# EAGLE design esp32_lora_gateway (EAGLE 9.1.1)
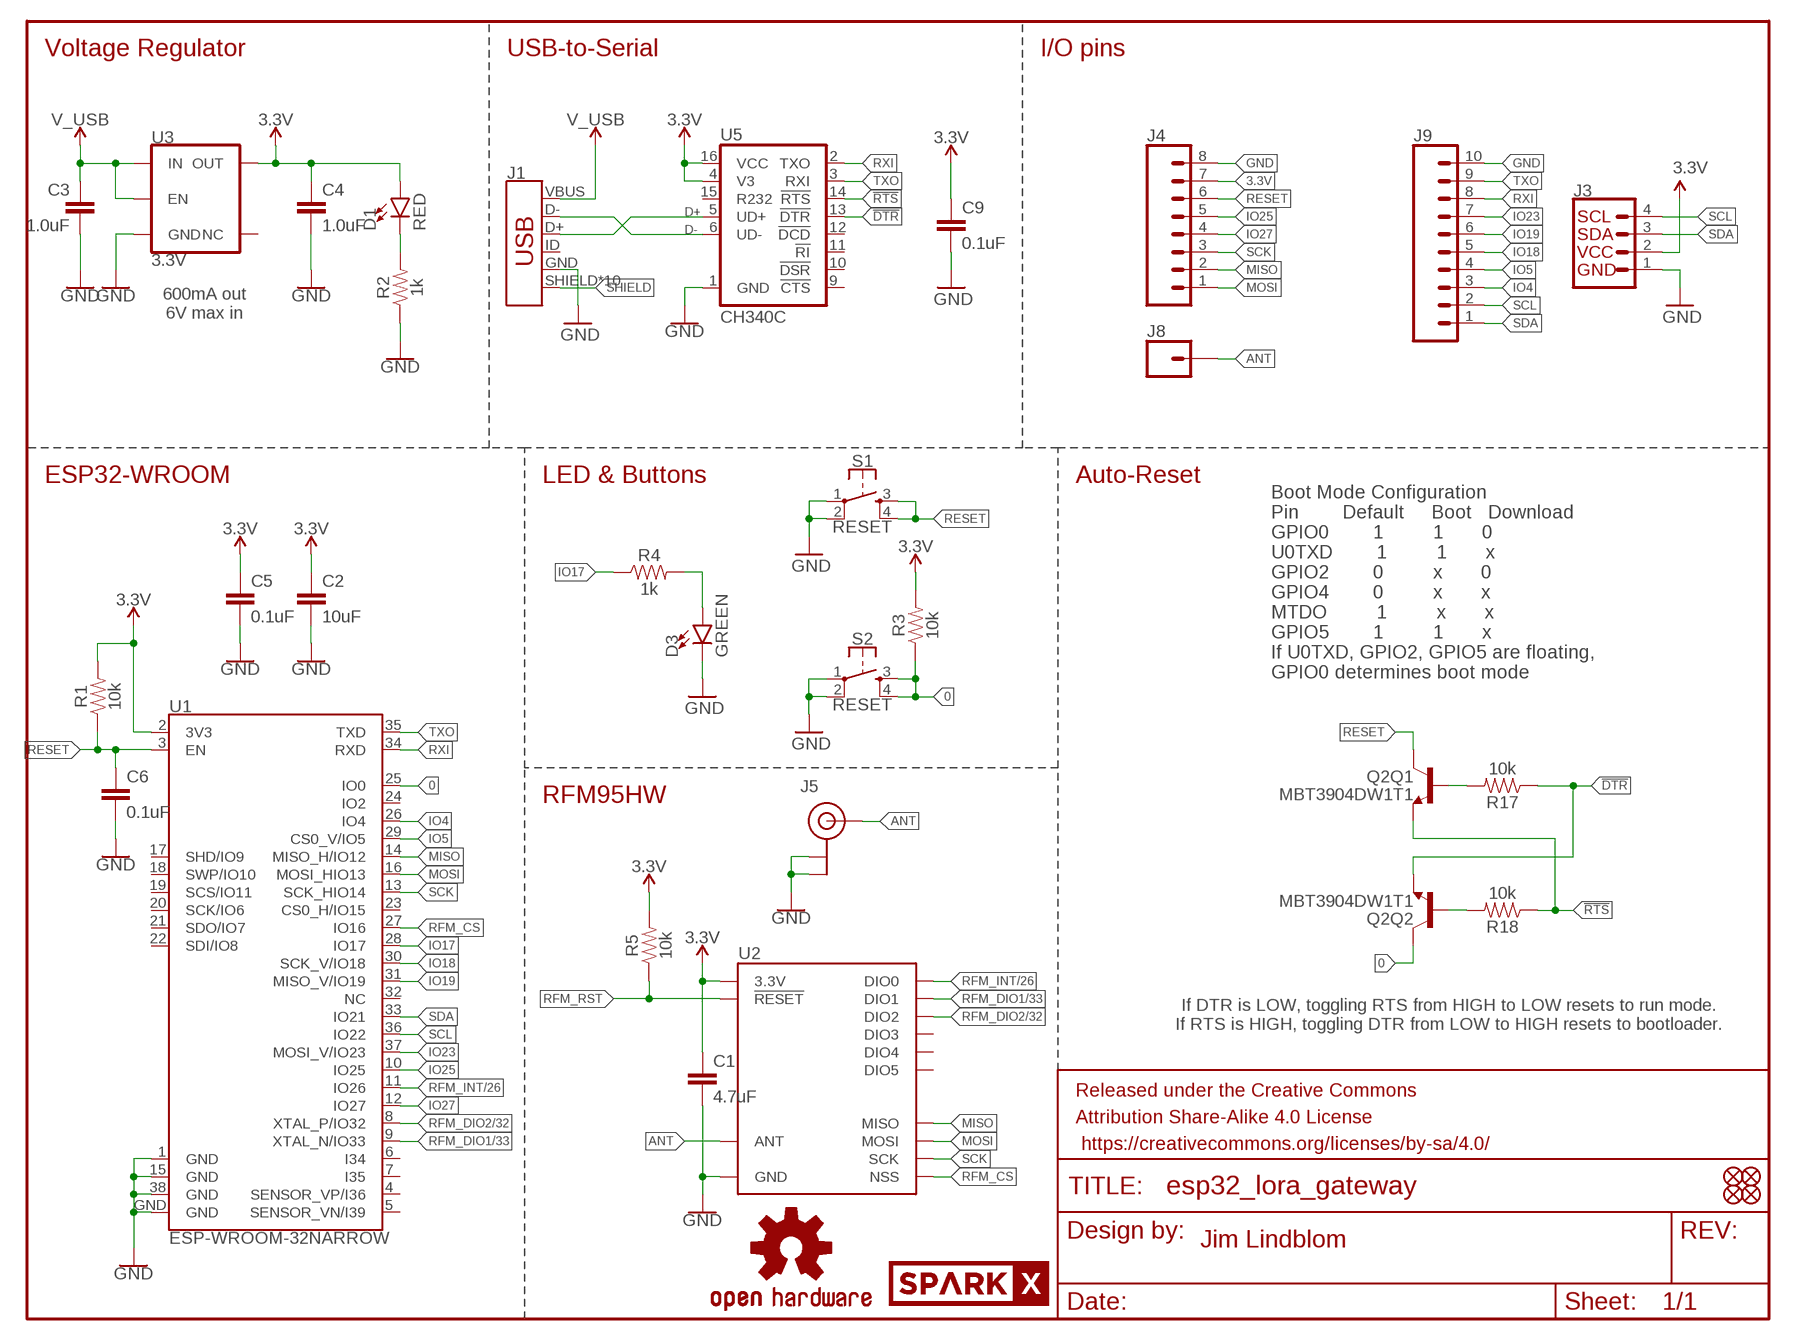
[diagram p0: schematic, sheet 1]

## Parts
C1  4.7uF  4.7UF-0603-6.3V-(10%)  [0603]
C2  10uF  10UF-0603-6.3V-20%  [0603]
C3  1.0uF  1.0UF-0603-16V-10%  [0603]
C4  1.0uF  1.0UF-0603-16V-10%  [0603]
C5  0.1uF  0.1UF-0603-25V-(+80/-20%)  [0603]
C6  0.1uF  0.1UF-0603-25V-(+80/-20%)  [0603]
C9  0.1uF  0.1UF-25V(+80/-20%)(0603)  [0603-CAP]
D1  RED  LED-RED0603  [LED-0603]
D3  GREEN  LED-GREEN0603  [LED-0603]
FD1  FIDUCIALUFIDUCIAL  [FIDUCIAL-MICRO]
FD2  FIDUCIALUFIDUCIAL  [FIDUCIAL-MICRO]
FD3  FIDUCIALUFIDUCIAL  [FIDUCIAL-MICRO]
FD4  FIDUCIALUFIDUCIAL  [FIDUCIAL-MICRO]
FRAME1  FRAME-LETTER  [CREATIVE_COMMONS]
J1  USB_MICRO-B_HALF_PTH_MILL  [USB-MICROB-PTH-MILL]
J3  QWIIC_CONNECTORJS-1MM  [1X04_1MM_RA]
J4  CONN_08NO_SILK_FEMALE_PTH  [1X08_NO_SILK]
J5  U.FL  [U.FL]
J8  CONN_01PTH_NO_SILK_YES_STOP  [1X01_NO_SILK]
J9  CONN_10NO_SILK_PTH_FEMALE  [1X10_NO_SILK]
LOGO1  SPARKX-LOGO4  [SPARKX-MEDIUM]
LOGO2  OSHW-LOGOM  [OSHW-LOGO-M]
Q2  MBT3904DW1T1  [SC70-6]
R1  10k  10KOHM-0603-1/10W-1%  [0603]
R2  1k  1KOHM-0603-1/10W-1%  [0603]
R3  10k  10KOHM-0603-1/10W-1%  [0603]
R4  1k  1KOHM-0603-1/10W-1%  [0603]
R5  10k  10KOHM-0603-1/10W-1%  [0603]
R17  10k  10KOHM-0603-1/10W-1%  [0603]
R18  10k  10KOHM-0603-1/10W-1%  [0603]
S1  RESET  MOMENTARY-SWITCH-SPST-2-SMD-4.6X2.8MM  [TACTILE_SWITCH_SMD_4.6X2.8MM]
S2  RESET  MOMENTARY-SWITCH-SPST-2-SMD-4.6X2.8MM  [TACTILE_SWITCH_SMD_4.6X2.8MM]
U1  ESP-WROOM-32NARROW  [ESP-WROOM-32-NARROW]
U2  RFM96W  [RFM95/96/97/98W]
U3  3.3V  V_REG_AP2112K-3.3V  [SOT23-5]
U5  CH340C  [SO016]

## Nets
0: Q2.6(Q2:C) R3.1 S2.3 S2.4 U1.25(IO0)
3.3V: C1.1 C2.1 C4.1 C5.1 C9.1 D1.A J3.2 J4.7 R1.2 R3.2 R5.2 U1.2(3V3) U2.3.3V U3.5(OUT) U5.4(V3) U5.16(VCC)
!DTR: Q2.1(Q2:E) R17.1 U5.13(!DTR)
!RTS: Q2.4(Q1:E) R18.1 U5.14(!RTS)
ANT: J5.FEED(SIGNAL) J8.1 U2.ANT
D+: J1.D+ U5.5(UD+)
D-: J1.D- U5.6(UD-)
GND: C1.2 C2.2 C3.2 C4.2 C5.2 C6.2 C9.2 D3.C J1.GND J3.1 J4.8 J5.1(GND) J5.2(GND) J9.10 R2.1 S1.1 S1.2 S2.1 S2.2 U1.1(GND) U1.15(GND) U1.38(GND) U1.GND U2.GND@1(GND) U2.GND@2(GND) U2.GND@3(GND) U3.2(GND) U5.1(GND)
IO4: J9.3 U1.26(IO4)
IO5: J9.4 U1.29(CS0_V/IO5)
IO17: R4.1 U1.28(IO17)
IO18: J9.5 U1.30(SCK_V/IO18)
IO19: J9.6 U1.31(MISO_V/IO19)
IO23: J9.7 U1.37(MOSI_V/IO23)
IO25: J4.5 U1.10(IO25)
IO27: J4.4 U1.12(IO27)
MISO: J4.2 U1.14(MISO_H/IO12) U2.MISO
MOSI: J4.1 U1.16(MOSI_HIO13) U2.MOSI
N$1: D1.C R2.2
N$2: D3.A R4.2
N$10: Q2.5(Q1:B) R17.2
N$12: Q2.2(Q2:B) R18.2
RESET: C6.1 J4.6 Q2.3(Q1:C) R1.1 S1.3 S1.4 U1.3(EN)
RFM_CS: U1.27(IO16) U2.NSS
RFM_DIO1/33: U1.9(XTAL_N/IO33) U2.DIO1
RFM_DIO2/32: U1.8(XTAL_P/IO32) U2.DIO2
RFM_INT/26: U1.11(IO26) U2.DIO0
RFM_RST: R5.1 U2.!RESET
RXI: J9.8 U1.34(RXD) U5.2(TXO)
SCK: J4.3 U1.13(SCK_HIO14) U2.SCK
SCL: J3.4 J9.2 U1.36(IO22)
SDA: J3.3 J9.1 U1.33(IO21)
SHIELD: J1.SHIELD J1.SHIELD2(SHIELD) J1.SHIELD3(SHIELD) J1.SHIELD4(SHIELD) J1.SHIELD5(SHIELD) J1.SHIELD6(SHIELD) J1.SHIELD7(SHIELD) J1.SHIELD8(SHIELD) J1.SHIELD9(SHIELD) J1.SHIELD10(SHIELD)
TXO: J9.9 U1.35(TXD) U5.3(RXI)
V_USB: C3.1 J1.VBUS U3.1(IN) U3.3(EN)
Unconnected: J1.ID U1.4(SENSOR_VP/I36) U1.5(SENSOR_VN/I39) U1.6(I34) U1.7(I35) U1.17(SHD/IO9) U1.18(SWP/IO10) U1.19(SCS/IO11) U1.20(SCK/IO6) U1.21(SDO/IO7) U1.22(SDI/IO8) U1.23(CS0_H/IO15) U1.24(IO2) U1.32(NC) U2.DIO3 U2.DIO4 U2.DIO5 U3.4(NC) U5.9(!CTS) U5.10(!DSR) U5.11(!RI) U5.12(!DCD) U5.15(R232)

## Notes on the sheet
- Voltage Regulator | USB-to-Serial | I/O pins
- 600mA out
  6V max in
- ESP32-WROOM | LED & Buttons | Auto-Reset
- Boot Mode Configuration
  Pin        Default     Boot   Download
  GPIO0        1         1       0
  U0TXD        1         1       x
  GPIO2        0         x       0
  GPIO4        0         x       x
  MTDO         1         x       x
  GPIO5        1         1       x
  If U0TXD, GPIO2, GPIO5 are floating, 
  GPIO0 determines boot mode
- RFM95HW
- If DTR is LOW, toggling RTS from HIGH to LOW resets to run mode.
  If RTS is HIGH, toggling DTR from LOW to HIGH resets to bootloader.
- Jim Lindblom

## Library data of the parts
C1 = SparkFun-Capacitors:4.7UF: 4.7µF ceramic capacitors A capacitor is a passive two-terminal electrical component used to store electrical energy temporarily in an electric field.; PROD_ID: CAP-08280
C2 = SparkFun-Capacitors:10UF: 10.0µF ceramic capacitors A capacitor is a passive two-terminal electrical component used to store electrical energy temporarily in an electric field.; PROD_ID: CAP-11015
C3 C4 = SparkFun-Capacitors:1.0UF: 1µF ceramic capacitors A capacitor is a passive two-terminal electrical component used to store electrical energy temporarily in an electric field.; PROD_ID: CAP-00868
C5 C6 = SparkFun-Capacitors:0.1UF: 0.1µF ceramic capacitors A capacitor is a passive two-terminal electrical component used to store electrical energy temporarily in an electric field.; PROD_ID: CAP-00810
C9 = SparkFun-Capacitors:0.1UF-25V(+80/-20%)(0603): CAP-00810 Ceramic Standard decoupling cap; PROD_ID: CAP-00810
D1 = SparkFun-LED:LED-RED: Red SMD LED Used in manufacturing of most products at SparkFun Packages: 0603 - SMD 0603 package [Product Link] <http://docs.avagotech.com/docs/AV02-0551EN> 0603 SMART - SMD 0603 SMART package ( more efficient and expensive)[Product Link] <http://www.osram-os.com/Graphics/XPic2/00077099_0.pdf> 1206 - SMD1206 package [Product Link] <https://www.sparkfun.com/datasheets/DevTools/LilyPad/Q150OVS4.pdff> SparkFun Products: Pro Mini 328 -5V <https://www.sparkfun.com/products/821> RedBoard <https://www.sparkfun.com/products/12757> IOIO-OTG <https://www.sparkfun.com/products/13613>; PROD_ID: DIO-00819
D3 = SparkFun-LED:LED-GREEN: Green SMD LED Used in manufacturing of various products at SparkFun Packages: 0603 - SMD 0603 package [Product Link] <http://www.futureelectronics.com/en/technologies/semiconductors/optoelectronics/leds/Pages/9894312-LTST-C190GKT.aspx?CrossPart=HSMG-C190&IM=0> LilyPad 1206 - SMD1206 LilyPad package [Product Link] <http://www.futureelectronics.com/en/Technologies/Product.aspx?ProductID=IN150NGHARVATEKCORPORATION2049943&IM=0> 1206 - SMD1206 package [Product Link] <http://www.futureelectronics.com/en/technologies/semiconductors/optoelectronics/leds/Pages/8315665-LTST-C150KGKT.aspx?IM=0> 1206 Bottom Mount -SMD 1206 Bottom Mount [Product Link] <http://www.digikey.com/product-detail/en/lite-on-inc/LTST-C230KGKT/160-1456-1-ND/386854> SparkFun Products: Pro Mini 328 -5V <https://www.sparkfun.com/products/821> RedBoard <https://www.sparkfun.com/products/12757> MP3 Trigger <https://www.sparkfun.com/products/13720> Makey Makey <https://www.sparkfun.com/products/11076>; PROD_ID: DIO-00821
FD1-FD4 = SparkFun-Aesthetics:FIDUCIAL: Fiducial Alignment Points Point-of-reference for pick-and-place machines and other optical instruments.
FRAME1 = SparkFun-Aesthetics:FRAME-LETTER: Schematic Frame - Letter Standard 8.5x11 US Letter frame
J1 = SparkFun-Connectors:USB_MICRO-B: USB Type Micro-B Connector Male/female and PTH/SMT variants SparkFun Products: SparkFun microB USB Breakout <https://www.sparkfun.com/products/12035> SparkFun USB microB Plug Breakout <https://www.sparkfun.com/products/10031> SparkFun ESP8266 Thing <https://www.sparkfun.com/products/13231>; PROD_ID: CONN-13711
J3 = SparkFun-Connectors:QWIIC_CONNECTOR: SparkFun I2C Standard Qwiic Connector An SMD 1mm pitch JST connector makes it easy and quick (get it? Qwiic?) to connect I2C devices to each other. The Qwiic system <http://www.sparkfun.com/qwiic> enables fast and solderless connection between popular platforms and various sensors and actuators. We carry 200mm <https://www.sparkfun.com/products/14204>, 100mm <https://www.sparkfun.com/products/14205>, 50mm <https://www.sparkfun.com/products/14206>, and breadboard friendly <https://www.sparkfun.com/products/14207> Qwiic cables. We also offer 10 pcs strips <https://www.sparkfun.com/products/14323> the SMD connectors.; PROD_ID: CONN-13694
J4 = SparkFun-Connectors:CONN_08: Multi connection point. Often used as Generic Header-pin footprint for 0.1 inch spaced/style header connections On any of the 0.1 inch spaced packages, you can populate with these: Break Away Headers - Straight <https://www.sparkfun.com/products/116> (PRT-00116) Break Away Male Headers - Right Angle <https://www.sparkfun.com/products/553> (PRT-00553) Female Headers <https://www.sparkfun.com/products/115> (PRT-00115) Break Away Headers - Machine Pin <https://www.sparkfun.com/products/117> (PRT-00117) Break Away Female Headers - Swiss Machine Pin <https://www.sparkfun.com/products/743> (PRT-00743) Arduino Stackable Header - 8 Pin <https://www.sparkfun.com/products/9279> (PRT-09279) For SCREWTERMINALS and SPRING TERMINALS visit here: Screw Terimnals on SparkFun.com <https://www.sparkfun.com/search/results?term=Screw+Terminals> (5mm/3.5mm/2.54mm spacing) This device is also useful as a general connection point to wire up your design to another part of your project. Our various solder wires solder well into these plated through hole pads. Hook-Up Wire - Assortment (Stranded, 22 AWG) <https://www.sparkfun.com/products/11375> (PRT-11375) Hook-Up Wire - Assortment (Solid Core, 22 AWG) <https://www.sparkfun.com/products/11367> (PRT-11367) View the entire wire category on our website here <https://www.sparkfun.com/categories/141> Special notes: Molex polarized connector foot print use with SKU : PRT-08231 with associated crimp pins and housings. 1MM SMD Version SKU: PRT-10208 NOTES ON THE VARIANTS LOCK and LOCK_LONGPADS... This footprint was designed to help hold the alignment of a through-hole component (i.e. 6-pin header) while soldering it into place. You may notice that each hole has been shifted either up or down by 0.005 of an inch from it's more standard position (which is a perfectly straight line). This slight alteration caused the pins (the squares in the middle) to touch the edges of the holes. Because they are alternating, it causes a "brace" to hold the component in place. 0.005 has proven to be the perfect amount of "off-center" position when using our standard breakaway headers. Although looks a little odd when you look at the bare footprint, once you have a header in there, the alteration is very hard to notice. Also,if you push a header all the way into place, it is covered up entirely on the bottom side.; PROD_ID: CONN-08438
J5 = SparkFun-Connectors:U.FL: SMD Antenna Connector - U.FL 2mm height, 3.0mm x 3.0mm receptacle size. SparkFun Products: SparkFun WiFi Shield - ESP8266 <https://www.sparkfun.com/products/13287> SparkFun ESP8266 Thing <https://www.sparkfun.com/products/13231> SparkFun MiniGen - Pro Mini Signal Generator Shield <https://www.sparkfun.com/products/11420>; PROD_ID: CONN-09193; SF_ID: WRL-09144
J8 = SparkFun-Connectors:CONN_01: Single connection point. Often used as Generic Header-pin footprint for 0.1 inch spaced/style header connections On any of the 0.1 inch spaced packages, you can populate with these: Break Away Headers - Straight <https://www.sparkfun.com/products/116> (PRT-00116) Break Away Male Headers - Right Angle <https://www.sparkfun.com/products/553> (PRT-00553) Female Headers <https://www.sparkfun.com/products/115> (PRT-00115) Break Away Headers - Machine Pin <https://www.sparkfun.com/products/117> (PRT-00117) Break Away Female Headers - Swiss Machine Pin <https://www.sparkfun.com/products/743> (PRT-00743) This device is also useful as a general connection point to wire up your design to another part of your project. Our various solder wires solder well into these plated through hole pads. Hook-Up Wire - Assortment (Stranded, 22 AWG) <https://www.sparkfun.com/products/11375> (PRT-11375) Hook-Up Wire - Assortment (Solid Core, 22 AWG) <https://www.sparkfun.com/products/11367> (PRT-11367) View the entire wire category on our website here <https://www.sparkfun.com/categories/141> Special notes: SMTSO-256-ET is a "flush mount" nut for a 4-40 screw. We mostly use this on specialty testbeds; it is a nice way to connect hardware to your PCB at an adjustable hieght. Also note, the SNAP packages are for using a snappable style connector. We sell a baggie of snaps and they are also used on two LilyPad designs: Snap Assortment - 30 pack (male and female) <https://www.sparkfun.com/products/11347> (DEV-11347) LilyPad Arduino SimpleSnap <https://www.sparkfun.com/products/10941> (DEV-10941) LilyPad SimpleSnap Protoboard <https://www.sparkfun.com/products/10940> (DEV-10940)
J9 = SparkFun-Connectors:CONN_10: Multi connection point. Often used as Generic Header-pin footprint for 0.1 inch spaced/style header connections On any of the 0.1 inch spaced packages, you can populate with these: Break Away Headers - Straight <https://www.sparkfun.com/products/116> (PRT-00116) Break Away Male Headers - Right Angle <https://www.sparkfun.com/products/553> (PRT-00553) Female Headers <https://www.sparkfun.com/products/115> (PRT-00115) Break Away Headers - Machine Pin <https://www.sparkfun.com/products/117> (PRT-00117) Break Away Female Headers - Swiss Machine Pin <https://www.sparkfun.com/products/743> (PRT-00743) Arduino Stackable Header - 10 Pin <https://www.sparkfun.com/products/11376> (PRT-11376) For SCREWTERMINALS and SPRING TERMINALS visit here: Screw Terimnals on SparkFun.com <https://www.sparkfun.com/search/results?term=Screw+Terminals> (5mm/3.5mm/2.54mm spacing) This device is also useful as a general connection point to wire up your design to another part of your project. Our various solder wires solder well into these plated through hole pads. Hook-Up Wire - Assortment (Stranded, 22 AWG) <https://www.sparkfun.com/products/11375> (PRT-11375) Hook-Up Wire - Assortment (Solid Core, 22 AWG) <https://www.sparkfun.com/products/11367> (PRT-11367) View the entire wire category on our website here <https://www.sparkfun.com/categories/141> Special notes: Molex polarized connector foot print use with SKU : PRT-08231 with associated crimp pins and housings. 1MM SMD Version SKU: PRT-10208 NOTES ON THE VARIANTS LOCK and LOCK_LONGPADS... This footprint was designed to help hold the alignment of a through-hole component (i.e. 6-pin header) while soldering it into place. You may notice that each hole has been shifted either up or down by 0.005 of an inch from it's more standard position (which is a perfectly straight line). This slight alteration caused the pins (the squares in the middle) to touch the edges of the holes. Because they are alternating, it causes a "brace" to hold the component in place. 0.005 has proven to be the perfect amount of "off-center" position when using our standard breakaway headers. Although looks a little odd when you look at the bare footprint, once you have a header in there, the alteration is very hard to notice. Also,if you push a header all the way into place, it is covered up entirely on the bottom side.; PROD_ID: CONN-11563
LOGO1 = SparkX:SPARKX-LOGO
LOGO2 = SparkFun-Aesthetics:OSHW-LOGO: Open-Source Hardware (OSHW) Logo This logo indicates the piece of hardware it is found on incorporates a OSHW license and/or adheres to the definition of open source hardware found here: http://freedomdefined.org/OSHW
Q2 = esp32-thing-temp:MBT3904DW1T1: MBT3904DW1 Dual NPN Transistors The MBT3904W1 puts two general purpose 3904 NPN transistors in a single package. Datasheet <http://www.onsemi.com/pub_link/Collateral/MBT3904DW1T1-D.PDF>; PROD_ID: TRANS-13337
R1 R3 R5 R17 R18 = SparkFun-Resistors:10KOHM: 10kΩ resistor A resistor is a passive two-terminal electrical component that implements electrical resistance as a circuit element. Resistors act to reduce current flow, and, at the same time, act to lower voltage levels within circuits. - Wikipedia; PROD_ID: RES-00824
R2 R4 = SparkFun-Resistors:1KOHM: 1kΩ resistor A resistor is a passive two-terminal electrical component that implements electrical resistance as a circuit element. Resistors act to reduce current flow, and, at the same time, act to lower voltage levels within circuits. - Wikipedia; PROD_ID: RES-07856
S1 S2 = SparkFun-Switches:MOMENTARY-SWITCH-SPST-2: Momentary Switch (Pushbutton) - SPST - Two Circuits Normally-open (NO) SPST momentary switches (buttons, pushbuttons). Schematic symbol includes two switch circuits. Variants SMD-4.6MMX2.8MM - 4.60mm x 2.80mm Tactile Momentary Button Switch - Used on SparkFun SAMD21 Mini Breakout <https://www.sparkfun.com/products/13664> SMD-5.2MM - Mini Pushbutton Switch - SMD <https://www.sparkfun.com/products/8720> - Used on Arduino Pro Mini <https://www.sparkfun.com/products/11114>; PROD_ID: SWCH-13065
U1 = esp32_lora_gateway:ESP-WROOM-32
U2 = SparkX:RFM96W
U3 = SparkFun-IC-Power:V_REG_AP2112: AP2112 - 600mA CMOS LDO Regulator w/ Enable The AP2112 is CMOS process low dropout linear regulator with enable function, the regulator delivers a guaranteed 600mA (min.) continuous load current. Features Output Voltage Accuracy: ±1.5% Output Current: 600mA (Min.) Foldback Short Current Protection: 50mA Enable Function to Turn ON/OFF VOUT Low Dropout Voltage (3.3V): 250mV (Typ.) @IOUT=600mA Excellent Load Regulation: 0.2%/A (Typ.) Excellent Line Regulation: 0.02%/V (Typ.) Low Quiescent Current: 55μA (Typ.) Low Standby Current: 0.01μA (Typ.) Low Output Noise: 50μVRMS PSRR: 100Hz -65dB, 1kHz -65dB OTSD Protection Stable with 1.0μF Flexible Cap: Ceramic, Tantalum and Aluminum Electrolytic Operation Temperature Range: -40°C to 85°C ESD: MM 400V, HBM 4000V; PROD_ID: VREG-12457
U5 = SparkFun-IC-Comms:CH340C; PROD_ID: IC-14038

## Net classes
0 default: width 0.152 mm, drill 0.305 mm
1 power: width 0.178 mm

## Board
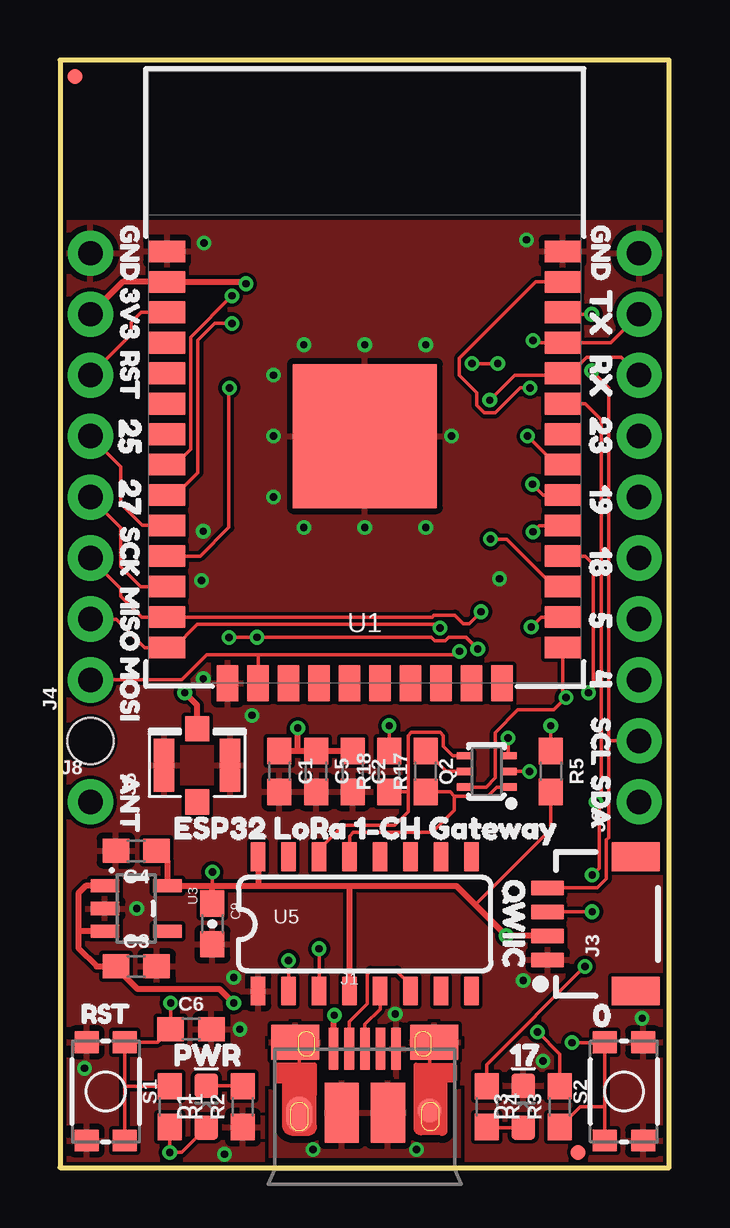
[diagram p1: board, top side]
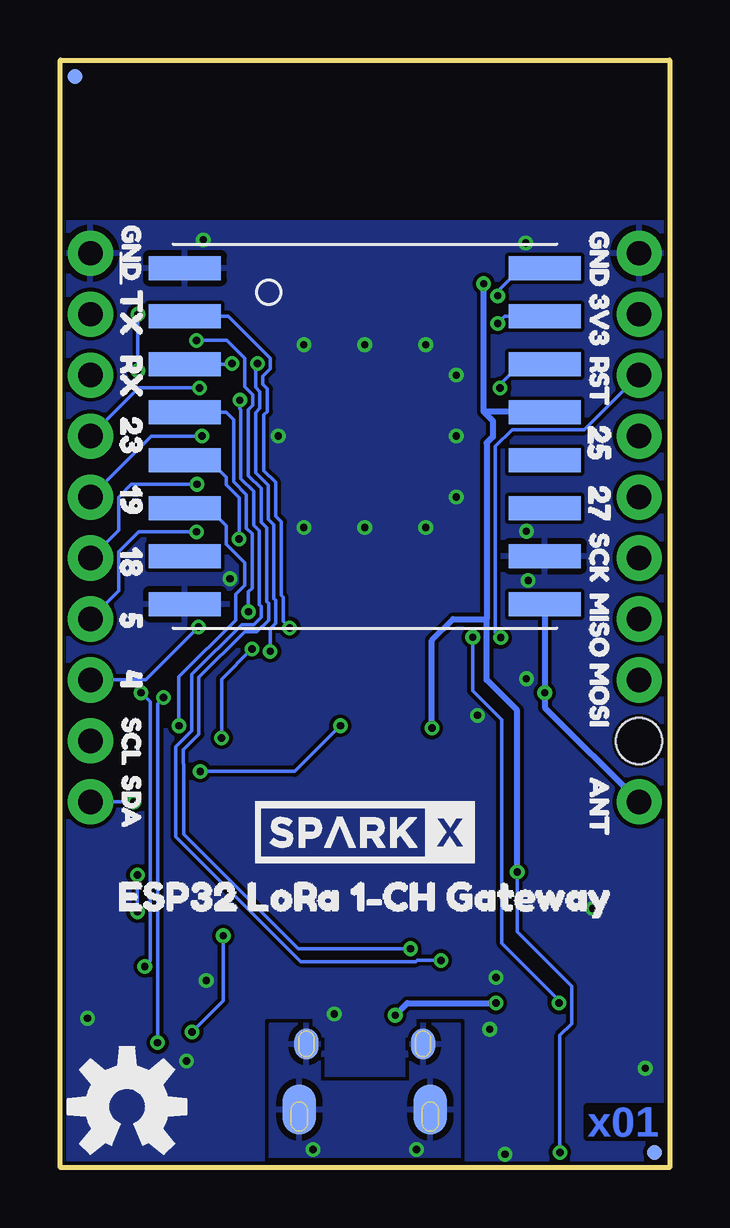
[diagram p2: board, bottom side, seen from below]

Size 25.38 x 46.15 mm. Coordinates in mm from the lower left corner, seen from the top.
Outline: 0,0 25.38,0 25.38,46.15 0,46.15 0,0
Copper layers (1*16): Top 0.035mm / dielectric 1.5mm / Bottom 0.035mm
Design rules "SparkFun-2-layer-PCBWay-LIMIT": minimum track width 6mil, minimum drill 0.3mm, track to track 6mil, track to pad 6mil, pad to pad 6mil, via to via 6mil, smd to smd 6mil, copper to edge 6mil, drill to drill 6mil, minimum pad ring 6mil, minimum via ring 6mil, stop-mask expansion 4mil, vias tented up to drill 25mil, thermal gap 10mil
Holes 1.93 mm at 1.27,17.78

### Footprints (pad centres in the part's own frame; a part is rotated, then mirrored left to right if it is on the bottom)
0603 = smd 1.1 x 1: 1 -0.85,0; 2 0.85,0
0603-CAP = smd 1.1 x 1: 1 -0.85,0; 2 0.85,0
LED-0603 = smd 1 x 1: A -0.877,0; C 0.877,0
FIDUCIAL-MICRO = smd 0.635 x 0.635: 1 0,0
USB-MICROB-PTH-MILL = smd 0.4 x 1.75: D+ 0,0; D- -0.65,0; GND 1.3,0; ID 0.65,0; VBUS -1.3,0 | smd 2 x 1.46: SHIELD -2.9,0.275; SHIELD2 2.9,0.275 | smd 1.425 x 2.5: SHIELD3 -0.963,-2.675; SHIELD4 0.963,-2.675 | smd 1.4 x 2.1 bottom: SHIELD5 -2.731,-2.531; SHIELD7 2.729,-2.531 | smd 1 x 1: SHIELD6 2.7,-2.575 | smd 1.1 x 1.5: SHIELD8 -2.731,-2.731 | smd 1 x 1.3 bottom: SHIELD9 -2.43,0.195; SHIELD10 2.43,0.195
1X04_1MM_RA = smd 0.6 x 1.35: 1 -1.5,0; 2 -0.5,0; 3 0.5,0; 4 1.5,0 | smd 1.2 x 2: NC1 2.8,-3.675; NC2 -2.8,-3.675
1X08_NO_SILK = drill 1.016 pad 1.88: 1 0,0; 2 2.54,0; 3 5.08,0; 4 7.62,0; 5 10.16,0; 6 12.7,0; 7 15.24,0; 8 17.78,0
U.FL = smd 2.2 x 0.85: 1 0,1.375; 2 0,-1.375 | smd 1.05 x 1: FEED 1.525,0; NC -1.525,0
1X01_NO_SILK = drill 1.016 pad 1.88: 1 0,0
1X10_NO_SILK = drill 1.016 pad 1.88: 1 0,0; 2 2.54,0; 3 5.08,0; 4 7.62,0; 5 10.16,0; 6 12.7,0; 7 15.24,0; 8 17.78,0; 9 20.32,0; 10 22.86,0
SC70-6 = smd 0.3 x 0.66: 1 -0.65,-0.92; 2 0,-0.92; 3 0.65,-0.92; 4 0.65,0.92; 5 0,0.92; 6 -0.65,0.92
TACTILE_SWITCH_SMD_4.6X2.8MM = smd 0.9 x 1: 1 -2.05,-0.8; 2 2.05,-0.8; 3 2.05,0.8; 4 -2.05,0.8
ESP-WROOM-32-NARROW = smd 0.9 x 1.5: 1 6.43,8.238; 2 5.16,8.238; 3 3.89,8.238; 4 2.62,8.238; 5 1.35,8.238; 6 0.08,8.238; 7 -1.19,8.238; 8 -2.46,8.238; 9 -3.73,8.238; 10 -5,8.238; 11 -6.27,8.238; 12 -7.54,8.238; 13 -8.81,8.238; 14 -10.08,8.238; 25 -10.08,-8.238; 26 -8.81,-8.238; 27 -7.54,-8.238; 28 -6.27,-8.238; 29 -5,-8.238; 30 -3.73,-8.238; 31 -2.46,-8.238; 32 -1.19,-8.238; 33 0.08,-8.238; 34 1.35,-8.238; 35 2.62,-8.238; 36 3.89,-8.238; 37 5.16,-8.238; 38 6.43,-8.238 | smd 1.5 x 0.9: 15 -11.57,5.715; 16 -11.57,4.445; 17 -11.57,3.175; 18 -11.57,1.905; 19 -11.57,0.635; 20 -11.57,-0.635; 21 -11.57,-1.905; 22 -11.57,-3.175; 23 -11.57,-4.445; 24 -11.57,-5.715 | smd 6 x 6: GND -1.27,0
RFM95/96/97/98W = smd 3 x 1: 3.3V 7.5,1; !RESET -7.5,-3; ANT 7.5,-7; DIO0 7.5,3; DIO1 7.5,5; DIO2 7.5,7; DIO3 7.5,-3; DIO4 7.5,-1; DIO5 -7.5,-5; GND@1 -7.5,7; GND@2 -7.5,-7; GND@3 7.5,-5; MISO -7.5,5; MOSI -7.5,3; NSS -7.5,-1; SCK -7.5,1
SOT23-5 = smd 0.55 x 1.2: 1 -0.95,-1.3; 2 0,-1.3; 3 0.95,-1.3; 4 0.95,1.3; 5 -0.95,1.3
SO016 = smd 0.6 x 1.2: 1 -4.445,-2.8; 2 -3.175,-2.8; 3 -1.905,-2.8; 4 -0.635,-2.8; 5 0.635,-2.8; 6 1.905,-2.8; 7 3.175,-2.8; 8 4.445,-2.8; 9 4.445,2.8; 10 3.175,2.8; 11 1.905,2.8; 12 0.635,2.8; 13 -0.635,2.8; 14 -1.905,2.8; 15 -3.175,2.8; 16 -4.445,2.8

### Placement (x,y rotation side)
C1  9.14,16.51 270 top
C2  12.19,16.51 270 top
C3  3.17,8.38 0 top
C4  3.17,13.21 180 top
C5  10.67,16.51 270 top
C6  5.46,5.77 0 top
C9  6.35,10.16 270 top
D1  6.1,2.54 90 top
D3  19.3,2.54 90 top
FD1  24.77,45.47 0 bottom
FD2  0.64,0.64 0 bottom
FD3  21.59,0.64 0 top
FD4  0.64,45.47 0 top
FRAME1  2.54,-7.62 0 top  (outside the outline)
J1  12.7,4.95 0 top
J3  20.32,10.16 90 top
J4  1.27,20.32 90 top
J5  5.71,16.76 90 top
J8  1.27,15.24 0 top
J9  24.13,15.24 90 top
LOGO1  12.7,13.97 0 bottom
LOGO2  22.61,2.54 0 bottom
Q2  17.78,16.51 90 top
R1  4.57,2.54 270 top
R2  7.62,2.54 90 top
R3  20.83,2.54 90 top
R4  17.78,2.54 270 top
R5  20.45,16.51 270 top
R17  15.24,16.51 90 top
R18  13.72,16.51 90 top
S1  1.91,3.17 270 top
S2  23.5,3.17 90 top
U1  12.7,31.75 90 top
U2  12.7,30.48 0 bottom
U3  3.17,10.79 270 top
U5  12.7,10.16 0 top
U$1  [GND0]  2.92,39.94 270 top
U$2  [3V31]  2.92,37.34 270 top
U$3  [RST2]  2.92,34.73 270 top
U$4  [2517]  2.92,32 270 top
U$5  [279]  2.92,29.46 270 top
U$6  [SCK3]  2.92,27.37 270 top
U$7  [MISO4]  2.92,24.89 270 top
U$8  [MOSI5]  2.92,21.97 270 top
U$9  [ANT6]  2.92,17.12 270 top
U$10  [GND0]  22.54,39.94 270 top
U$11  [TX16]  22.54,37.34 270 top
U$12  [RX15]  22.54,34.67 270 top
U$13  [2314]  22.54,32.07 270 top
U$14  [1912]  22.54,29.21 270 top
U$15  [1811]  22.54,26.67 270 top
U$16  [513]  22.54,23.94 270 top
U$17  [410]  22.54,21.53 270 top
U$18  [SCL8]  22.54,19.43 270 top
U$19  [SDA7]  22.54,17.02 270 top
U$20  [RST2]  0.19,6.41 0 top
U$21  [020]  21.4,6.35 0 top
U$22  [PWR19]  3.94,4.7 0 top
U$23  [1722]  17.97,4.7 0 top
U$24  [QWIIC18]  18.92,12.95 270 top
U$25  [ESP32_LORA_1#CH_GATEWAY21]  3.94,14.16 0 top
U$26  [GND0]  22.42,39.94 270 bottom
U$27  [TX16]  22.42,37.34 270 bottom
U$28  [RX15]  22.42,34.67 270 bottom
U$29  [2314]  22.42,32.07 270 bottom
U$30  [1912]  22.42,29.21 270 bottom
U$31  [1811]  22.42,26.67 270 bottom
U$32  [513]  22.42,23.94 270 bottom
U$33  [410]  22.42,21.53 270 bottom
U$34  [SCL8]  22.42,19.43 270 bottom
U$35  [SDA7]  22.42,17.02 270 bottom
U$36  [ANT6]  2.92,16.99 270 bottom
U$37  [GND0]  2.92,39.69 270 bottom
U$38  [3V31]  2.92,37.08 270 bottom
U$39  [RST2]  2.92,34.48 270 bottom
U$40  [2517]  2.92,31.75 270 bottom
U$41  [279]  2.92,29.21 270 bottom
U$42  [SCK3]  2.92,27.11 270 bottom
U$43  [MISO4]  2.92,24.64 270 bottom
U$44  [MOSI5]  2.92,21.72 270 bottom
U$45  [ESP32_LORA_1#CH_GATEWAY23]  24,11.3 0 bottom

### Tracks (layer width: path | path; a pad name or v marks a point on that pad's centre or on a via)
0  (via drill 0.3)
  Top 0.152: Q2.6 17.77,15.86 18.14,16.24 18.14,17.68 18.14,17.69 18.14,18.13 19.08,19.07 20.57,19.07 v21.08,19.59 20.94,19.73 U1.25 20.94,21.59 | v21.34,5.21 22.68,5.21 | 22.68,5.21 S2.3 | S2.4 22.7,2.54 | 22.7,2.54 22.7,5.19 22.68,5.21 | R3.1 21.68,2.54 22.7,2.54
  Bottom 0.152: v21.08,19.59 21.34,19.34 v21.34,5.21
3.3V  (via drill 0.3)
  Top 0.152: R1.2 v4.57,0.64 5.07,0.64 D1.A | v6.35,12.32 6.35,11.74 | R5.2 20.45,14.1 17.3,10.95 | R3.2 20.83,4.72 v19.9,5.66
  Top 0.254: v7.75,36.83 7.67,36.91 U1.2 2.62,36.91 J4.7 | C4.1 4.47,12.76 U3.5 6.35,11.74 | 6.35,11.74 8.26,11.74 | 8.26,11.74 12.06,11.74 | 12.06,11.74 16.51,11.74 17.3,10.95 v18.59,9.66 J3.2 | U5.16 8.26,11.74 | C9.1 6.35,11.74 | U5.4 12.06,11.74 | C2.1 C5.1 9.91,17.36 | 9.91,17.36 C1.1 | 9.91,17.36 v9.91,18.31
  Bottom 0.152: v4.57,0.64 4.57,5.51 4.08,6 4.08,7.56 6.35,9.83 v6.35,12.32 | v19.9,5.66 18.59,6.96 v18.59,9.66
  Bottom 0.254: 7.62,22.86 7.62,20.32 6.35,19.05 v6.35,12.32 | 7.75,31.5 v7.75,36.83 | U2.3.3V 5.22,31.5 7.75,31.5 | v9.91,18.31 9.91,21.97 9.02,22.86 7.62,22.86 | 7.75,31.5 7.37,31.11 7.37,30.45 7.62,30.2 7.62,22.86
!DTR
  Top 0.152: 12.06,13.21 U5.13 12.06,13.82 12.22,13.97 15.52,13.97 16.43,14.88 16.43,15.48 | R17.1 16.26,15.66 16.43,15.48 | 16.43,15.48 17.82,15.48 18.2,15.86 Q2.1
!RTS
  Top 0.152: Q2.4 16.37,17.16 15.97,17.56 15.97,18 15.84,18.14 14.64,18.14 14.51,18 14.51,15.66 | R18.1 14.51,15.66 | U5.14 10.79,13.26 11.81,14.28 13.95,14.28 14.5,14.83 14.5,15.65 14.51,15.66
ANT  (via drill 0.3)
  Top 0.254: J5.FEED 5.71,19.27 v5.2,19.79
  Bottom 0.254: 4.18,23.48 U2.ANT v5.2,19.79 5.2,19.17 J8.1
D+
  Top 0.152: J1.D+ 12.7,5.97 13.34,6.6 U5.5
D-
  Top 0.152: J1.D- 12.05,6.08 12.81,6.84 12.81,8.05 12.94,8.19 14.04,8.19 14.61,7.62 U5.6
GND  (via drill 0.3)
  other vias: 12.7,34.29 12.7,26.67 8.89,30.48 8.89,27.94 10.16,26.67 8.89,33.02 10.16,34.29 15.24,34.29 1.02,4.14 20.13,4.45 24.26,6.22 19.43,38.66 5.99,38.53 3.2,10.79 7.24,7.92 5.89,24.46 5.97,26.52 18.31,24.54 16.31,30.48 15.24,26.67 6.86,0.56 7.49,5.77 13.97,6.4 19.3,7.8 5.97,20.37 8,18.85
  pour Top (isolate 0.152, rank 6): 0,0 0,39.37 25.4,39.37 25.4,0
  pour Bottom (isolate 0.152, rank 6): 25.4,0 25.4,39.37 0,39.37 0,0
IO4  (via drill 0.3)
  Top 0.152: U1.26 20.05,22.94 v19.63,22.52
  Bottom 0.152: v19.63,22.52 21.84,20.32 J9.3
IO5  (via drill 0.3)
  Top 0.152: U1.29 19.97,26.75 v19.71,26.49
  Bottom 0.152: v19.71,26.49 22.12,26.49 22.96,25.65 22.96,24.03 J9.4
IO17  (via drill 0.3)
  Top 0.152: R4.1 17.78,4.29 v21.87,8.38 | v22.02,19.79 22.23,19.99 22.23,25.15 21.89,25.48 U1.28
  Bottom 0.152: v21.87,8.38 21.64,8.61 21.64,19.41 v22.02,19.79
IO18  (via drill 0.3)
  Top 0.152: U1.30 20.14,28.02 v19.68,28.47
  Bottom 0.152: v19.68,28.47 22.43,28.47 22.96,27.94 22.96,26.57 J9.5
IO19  (via drill 0.3)
  Top 0.152: U1.31 20.67,29.29 v19.48,30.48
  Bottom 0.152: v19.48,30.48 21.59,30.48 J9.6
IO23  (via drill 0.3)
  Top 0.152: U1.37 19.82,36.91 16.64,33.72 16.64,33.02 17.37,32.28 17.37,31.76 17.69,31.45 18.13,31.45 19.17,32.49 v19.58,32.49
  Bottom 0.152: v19.58,32.49 22.12,32.49 J9.7
IO25
  Top 0.152: J4.5 2.54,29.21 2.54,27.66 3.43,26.77 4.44,26.77 U1.10
IO27
  Top 0.152: J4.4 2.54,26.67 2.54,25.04 3.37,24.21 U1.12
MISO  (via drill 0.3)
  Top 0.152: J4.2 2.34,22.86 3.53,21.67 U1.14 4.75,21.67 5.72,22.64 15.68,22.64 v15.83,22.49
  Bottom 0.152: U2.MISO 18.39,35.48 16.64,33.72 16.64,33.28 16.95,32.97 16.95,32.63 16.76,32.45 16.76,31.5 16.91,31.36 16.91,29.04 16.41,28.55 16.41,27.15 16.18,26.91 16.18,23.84 16.1,23.76 16.1,22.76 v15.83,22.49
MOSI  (via drill 0.3)
  Top 0.152: 8.26,20.43 U1.16 8.26,21.36 | v16.64,21.51 16.49,21.36 8.26,21.36 | v17.17,33.5 v18.24,33.5 | J4.1 5.08,20.32 6.12,21.36 8.26,21.36
  Bottom 0.152: U2.MOSI 18.26,33.48 v18.24,33.5 | v17.17,33.5 17.25,33.42 17.25,32.51 17.07,32.33 17.07,31.63 17.25,31.45 17.25,28.96 16.72,28.43 16.72,27.02 16.48,26.79 16.48,23.71 16.41,23.63 16.41,22.69 16.64,22.45 v16.64,21.51
N$1
  Top 0.152: D1.C 7.59,3.42 R2.2
N$2
  Top 0.152: D3.A 17.81,1.66 R4.2
N$10
  Top 0.152: R17.2 16.09,16.51 Q2.5
N$12  (via drill 0.3)
  Top 0.152: v19.56,16.51 Q2.2 | R18.2 v13.72,18.41
  Bottom 0.152: v19.56,16.51 15.62,16.51 v13.72,18.41
RESET  (via drill 0.3)
  Top 0.152: v18.67,17.91 18.67,17.19 Q2.3 | S1.3 2.71,3.39 | 2.71,3.39 S1.4 4.07,5.22 C6.1 v4.61,6.86 | R1.1 2.71,3.39 | 16.97,22.05 v17.4,21.61 16.92,22.1 16.19,22.1 16.05,21.96 15.61,21.96 15.47,22.1 v8.2,22.1 v7.05,22.1 v7.04,22.09 | U1.3 3.38,35.64 2.97,35.23 2.97,34.72 J4.6
  Bottom 0.152: v4.61,6.86 4.61,6.97 6.99,9.35 6.99,18.66 8.2,19.88 v8.2,22.1 | v7.04,22.09 7.26,22.32 7.26,30.05 6.56,30.75 3.56,30.75 1.29,33.02 J4.6 | v18.67,17.91 18.67,20.35 v17.4,21.61
RFM_CS  (via drill 0.3)
  Top 0.152: U1.27 20.6,24.21 18.61,26.19 v17.94,26.19
  Bottom 0.152: U2.NSS 19.19,29.48 18.47,28.76 18.47,28.45 17.94,27.92 v17.94,26.19
RFM_DIO1/33  (via drill 0.3)
  Top 0.152: v7.16,35.18 6.45,35.18 5.75,34.48 5.75,28.96 4.8,28.02 U1.9
  Bottom 0.152: 6.47,35.76 5.48,35.76 U2.DIO1 6.86,35.48 v7.16,35.18
RFM_DIO2/32  (via drill 0.3)
  Top 0.152: U1.8 4.8,29.29 5.44,29.93 5.44,34.6 v7.16,36.33
  Bottom 0.152: v7.16,36.33 7.16,36.52 6.21,37.48 U2.DIO2
RFM_INT/26  (via drill 0.3)
  Top 0.152: U1.11 5.84,25.48 7.04,26.68 7.04,32.46 v7.06,32.49
  Bottom 0.152: U2.DIO0 6.22,33.48 7.06,32.64 v7.06,32.49
RFM_RST  (via drill 0.3)
  Top 0.152: R5.1 v20.45,18.41
  Bottom 0.152: v20.45,18.41 20.45,20.45 18.08,22.81 18.08,23.89 17.7,24.27 17.7,25.2 18.47,25.97 18.47,26.75 19.2,27.48 U2.!RESET
RXI  (via drill 0.3)
  Top 0.152: U5.2 v9.53,8.64 | v17.91,31.98 18.95,33.02 20.86,33.02 U1.34 21.29,33.1 21.95,33.76 23.39,33.76 J9.8
  Bottom 0.152: v9.53,8.64 10.52,8.64 10.57,8.59 15.37,8.59 20.57,13.79 20.57,17.53 19.91,18.19 19.91,20.55 17.84,22.63 17.33,22.63 17.01,22.94 17.01,23.38 17.09,23.46 17.09,26.53 17.33,26.77 17.33,28.17 17.86,28.71 17.86,31.58 17.91,31.62 v17.91,31.98
SCK  (via drill 0.3)
  Top 0.152: v17.55,23.16 17.06,22.67 16.81,22.67 16.46,23.02 15.58,23.02 15.5,22.94 U1.13 3.4,22.94 2.54,23.8 2.54,24.13 J4.3
  Bottom 0.152: 19.16,31.48 U2.SCK 18.48,31.48 18.17,31.17 18.17,28.58 17.63,28.05 17.63,26.64 17.4,26.41 17.4,24.14 17.55,23.99 v17.55,23.16
SCL  (via drill 0.3)
  Top 0.152: v22.16,35.56 21.02,35.56 U1.36 | 22.86,17.78 22.86,32.5 v22.16,33.2 | 22.86,17.78 22.86,13.75 22.77,13.65 22.77,12.03 22.39,11.66 J3.4 | J9.2 22.86,17.78
  Bottom 0.152: v22.16,35.56 v22.16,33.2
SDA  (via drill 0.3)
  Top 0.152: J3.3 v22.17,10.66 | 21.02,31.75 U1.33 21.89,31.83 22.55,31.17 22.55,15.47 v22.33,15.24 22.46,15.11 22.46,13.32 22.46,12.48 v22.17,12.19
  Bottom 0.152: v22.17,10.66 v22.17,12.19 | J9.1 v22.33,15.24
SHIELD  (via drill 0.3)
  Top 0.152: 15.24,5.08 15.45,5.08 J1.SHIELD2 15.4,5.03 J1.SHIELD6 | J1.SHIELD 9.97,5.06 J1.SHIELD8
  other vias: 10.54,0.76 14.86,0.76
  pour Top (isolate 0.305): 8.76,0 8.76,5.97 10.79,5.97 10.79,3.56 14.61,3.56 14.61,5.97 16.64,5.97 16.64,0.13 16.51,0
  pour Bottom (isolate 0.305): 16.64,0 16.64,5.97 14.61,5.97 14.61,3.56 10.79,3.56 10.79,5.97 8.76,5.97 8.76,0
TXO  (via drill 0.3)
  Top 0.152: U5.3 v10.79,9.12 | v19.71,34.47 19.81,34.37 U1.35 22.94,34.37 J9.9
  Bottom 0.152: v10.79,9.12 15.47,9.12 20.24,13.89 20.24,16.82 20.27,16.84 20.27,17.41 19.61,18.07 19.61,20.42 17.71,22.32 17.2,22.32 16.71,22.81 16.71,23.51 16.79,23.59 16.79,26.66 17.02,26.89 17.02,28.3 17.56,28.83 17.56,31.57 17.37,31.76 17.37,32.2 17.7,32.53 17.7,33.72 18.45,34.47 v19.71,34.47
V_USB  (via drill 0.3)
  Top 0.254: J1.VBUS 11.4,6.32 v11.43,6.35 | U3.1 1.08,11.74 0.76,11.43 0.76,9.85 | 0.76,9.85 0.76,9.14 1.52,8.38 C3.1 2.33,8.36 3.24,7.44 6.66,7.44 v7.24,6.86 | U3.3 0.76,9.85
  Bottom 0.254: v11.43,6.35 10.92,6.86 v7.24,6.86

### Text on the board
Bottom: x01
tDocu: Jim Lindblom